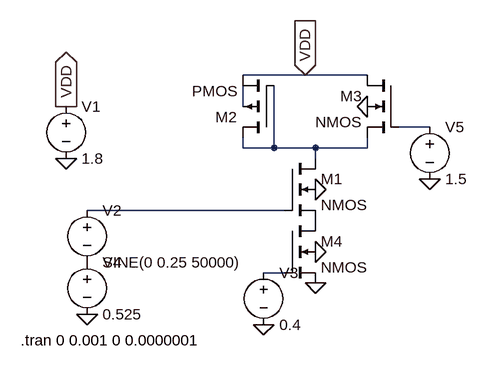
[diagram p0: schematic Simple_VGA.asc]
Simple_VGA.asc, the LTspice schematic file:
Version 4
SHEET 1 880 680
WIRE 256 48 160 48
WIRE 352 48 256 48
WIRE 160 96 160 64
WIRE 448 128 400 128
WIRE 160 160 160 144
WIRE 208 160 208 64
WIRE 208 160 160 160
WIRE 272 160 208 160
WIRE 352 160 352 144
WIRE 352 160 272 160
WIRE 272 176 272 160
WIRE 224 256 -80 256
WIRE 224 352 192 352
FLAG 352 96 0
FLAG 272 224 0
FLAG 272 320 0
FLAG 256 48 VDD
IOPIN 256 48 In
FLAG -112 96 VDD
IOPIN -112 96 Out
FLAG 272 368 0
FLAG 192 432 0
FLAG -112 176 0
FLAG -80 416 0
FLAG 448 208 0
SYMBOL nmos4 224 176 R0
SYMATTR InstName M1
SYMATTR Value2 l=100nm w=120nm
SYMBOL pmos4 208 144 R180
SYMATTR InstName M2
SYMATTR Value2 l=1um w=180nm
SYMBOL nmos4 400 48 M0
SYMATTR InstName M3
SYMATTR Value2 l=100nm w=120nm
SYMBOL nmos4 224 272 R0
SYMATTR InstName M4
SYMATTR Value2 l=100nm w=120nm
SYMBOL voltage -112 80 R0
WINDOW 123 0 0 Left 0
WINDOW 39 0 0 Left 0
SYMATTR InstName V1
SYMATTR Value 1.8
SYMBOL voltage -80 240 R0
WINDOW 123 0 0 Left 0
WINDOW 39 0 0 Left 0
SYMATTR InstName V2
SYMATTR Value SINE(0 0.25 50000)
SYMBOL voltage 192 336 R0
WINDOW 123 0 0 Left 0
WINDOW 39 0 0 Left 0
SYMATTR InstName V3
SYMATTR Value 0.4
SYMBOL voltage -80 320 R0
WINDOW 123 0 0 Left 0
WINDOW 39 0 0 Left 0
SYMATTR InstName V4
SYMATTR Value 0.525
SYMBOL voltage 448 112 R0
WINDOW 123 0 0 Left 0
WINDOW 39 0 0 Left 0
SYMATTR InstName V5
SYMATTR Value 1.5
TEXT -182 456 Left 2 !.tran 0 0.001 0 0.0000001

The netlist it stands for:
* Simple_VGA.asc
M1 N003 N004 P001 0 NMOS l=100nm w=120nm
M2 N003 N003 VDD N001 PMOS l=1um w=180nm
M3 VDD N002 N003 0 NMOS l=100nm w=120nm
M4 P001 N005 0 0 NMOS l=100nm w=120nm
V1 VDD 0 1.8
V2 N004 P002 SINE(0 0.25 50000)
V3 N005 0 0.4
V4 P002 0 0.525
V5 N002 0 1.5
.model NMOS NMOS
.model PMOS PMOS
.lib standard.mos
.tran 0 0.001 0 0.0000001
.backanno
.end